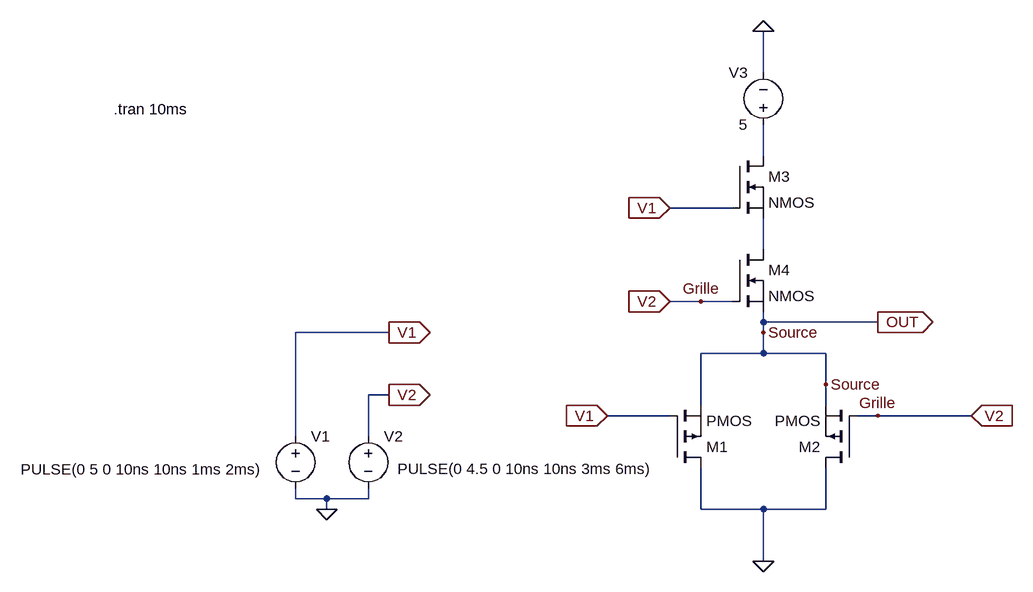
[diagram p0: schematic Draft2.asc]
Draft2.asc, the LTspice schematic file:
Version 4
SHEET 1 880 680
WIRE 112 -448 112 -512
WIRE 112 -320 112 -368
WIRE 64 -240 -32 -240
WIRE 112 -176 112 -224
WIRE 16 -96 -32 -96
WIRE 64 -96 16 -96
WIRE 112 -64 112 -80
WIRE 288 -64 112 -64
WIRE -464 -48 -608 -48
WIRE 112 -48 112 -64
WIRE 112 -16 112 -48
WIRE 112 -16 16 -16
WIRE 208 -16 112 -16
WIRE 208 32 208 -16
WIRE -464 48 -496 48
WIRE 16 64 16 -16
WIRE 208 64 208 32
WIRE -32 80 -128 80
WIRE 288 80 256 80
WIRE 432 80 288 80
WIRE -608 112 -608 -48
WIRE -496 112 -496 48
WIRE -608 208 -608 192
WIRE -560 208 -608 208
WIRE -496 208 -496 192
WIRE -496 208 -560 208
WIRE -560 224 -560 208
WIRE 16 224 16 160
WIRE 112 224 16 224
WIRE 208 224 208 160
WIRE 208 224 112 224
WIRE 112 304 112 224
FLAG -560 224 0
FLAG 112 304 0
FLAG 112 -512 0
FLAG 288 -64 OUT
IOPIN 288 -64 Out
FLAG -464 48 V2
IOPIN -464 48 Out
FLAG -464 -48 V1
IOPIN -464 -48 Out
FLAG -32 -240 V1
IOPIN -32 -240 In
FLAG -32 -96 V2
IOPIN -32 -96 In
FLAG -128 80 V1
IOPIN -128 80 In
FLAG 432 80 V2
IOPIN 432 80 In
FLAG 208 32 Source
FLAG 288 80 Grille
FLAG 112 -48 Source
FLAG 16 -96 Grille
SYMBOL voltage -608 96 R0
WINDOW 3 -423 67 Left 2
WINDOW 123 0 0 Left 0
WINDOW 39 0 0 Left 0
SYMATTR Value PULSE(0 5 0 10ns 10ns 1ms 2ms)
SYMATTR InstName V1
SYMBOL voltage 112 -352 R180
WINDOW 0 24 96 Left 2
WINDOW 3 24 16 Left 2
WINDOW 123 0 0 Left 0
WINDOW 39 0 0 Left 0
SYMATTR InstName V3
SYMATTR Value 5
SYMBOL voltage -496 96 R0
WINDOW 3 45 66 Left 2
WINDOW 123 0 0 Left 0
WINDOW 39 0 0 Left 0
SYMATTR Value PULSE(0 4.5 0 10ns 10ns 3ms 6ms)
SYMATTR InstName V2
SYMBOL pmos -32 160 M180
SYMATTR InstName M1
SYMBOL pmos 256 160 R180
SYMATTR InstName M2
SYMBOL nmos 64 -320 R0
SYMATTR InstName M3
SYMBOL nmos 64 -176 R0
SYMATTR InstName M4
TEXT -888 -392 Left 2 !.tran 10ms

The netlist it stands for:
* Draft2.asc
V1 V1 0 PULSE(0 5 0 10ns 10ns 1ms 2ms)
V3 N001 0 5
V2 Grille 0 PULSE(0 4.5 0 10ns 10ns 3ms 6ms)
M1 0 V1 Source Source PMOS
M2 0 Grille Source Source PMOS
M3 N001 V1 N002 N002 NMOS
M4 N002 Grille Source Source NMOS
.model NMOS NMOS
.model PMOS PMOS
.lib standard.mos
.tran 10ms
.backanno
.end